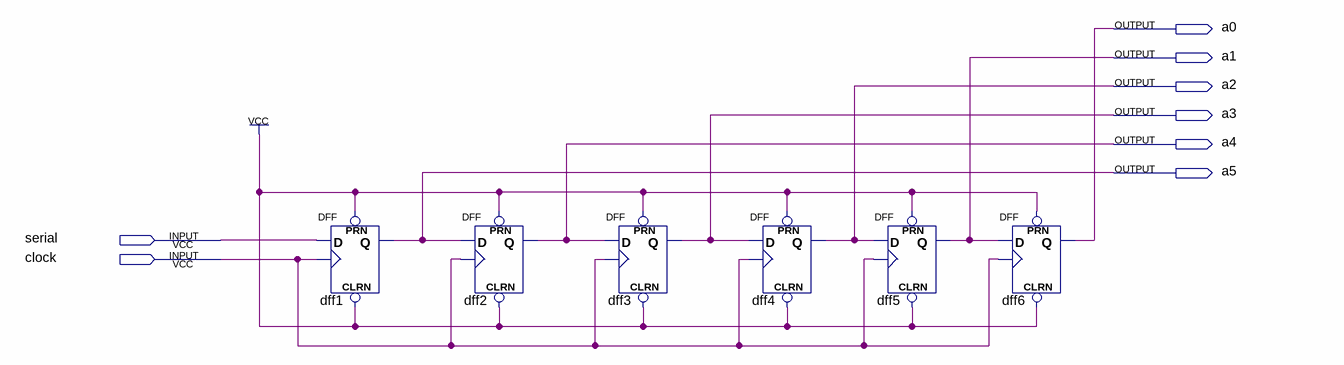
[diagram p0: schematic sheet]
// Quartus schematic deslocamento.bdf as structural Verilog: 6 symbols, 8 pins
module deslocamento (
  input  serial,
  input  clock,
  output a0,
  output a1,
  output a2,
  output a3,
  output a4,
  output a5
);

  DFF dff1 (.CLRN(1'b1), .CLK(clock), .D(serial), .PRN(1'b1), .Q(a5));
  DFF dff2 (.CLRN(1'b1), .CLK(clock), .D(a5), .PRN(1'b1), .Q(a4));
  DFF dff3 (.CLRN(1'b1), .CLK(clock), .D(a4), .PRN(1'b1), .Q(a3));
  DFF dff4 (.CLRN(1'b1), .CLK(clock), .D(a3), .PRN(1'b1), .Q(a2));
  DFF dff5 (.CLRN(1'b1), .CLK(clock), .D(a2), .PRN(1'b1), .Q(a1));
  DFF dff6 (.CLRN(1'b1), .CLK(clock), .D(a1), .PRN(1'b1), .Q(a0));
endmodule
